# Altium schematic sheet Trigger.SchDoc
size A; SheetNumber: 5; SheetTotal: 6
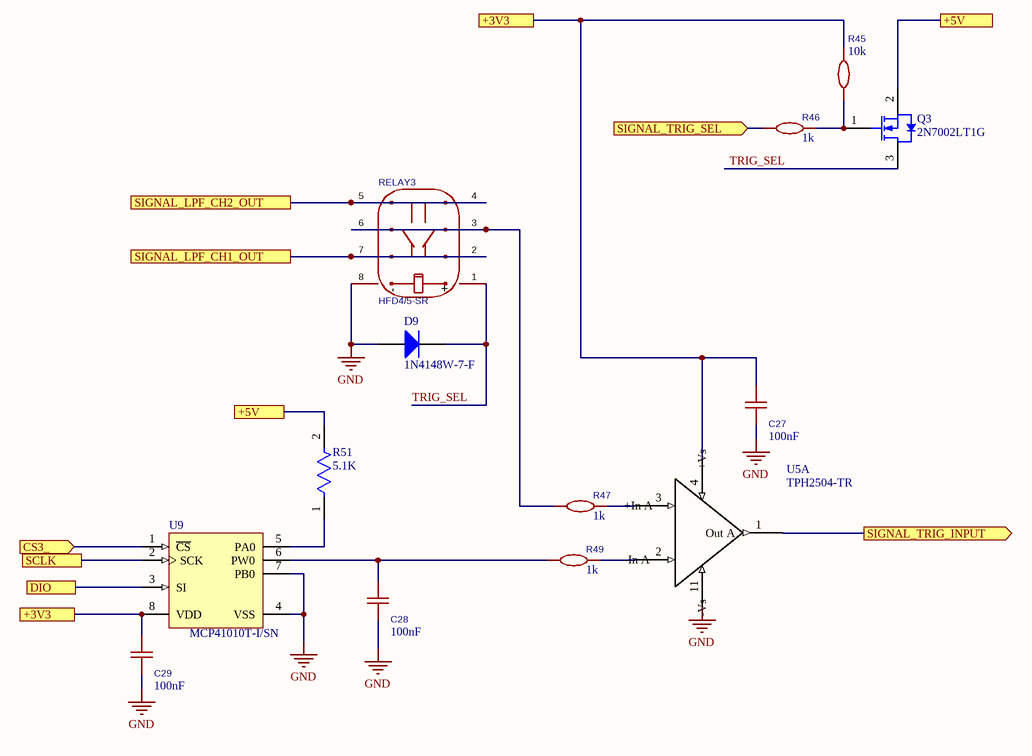
[diagram p0: Trigger.SchDoc]

## Parts
C27  value 100nF  [C0805]  (hidden comment: 0805CG6R0C500NT_C67560)
C28  value 100nF  [C0805]  (hidden comment: 0805CG6R0C500NT_C67560)
C29  value 100nF  [C0805]  (hidden comment: 0805CG6R0C500NT_C67560)
D9  1N4148W-7-F  [DIOD-SOD123-2_V]
Q3  2N7002LT1G  [ONSC-SOT-23-3-318-08_V]
R45  value 10k  [R0805]  (hidden comment: 0805W8F0000T5E_C17477)
R46  value 1k  [R0805]  (hidden comment: 0805W8F0000T5E_C17477)
R47  value 1k  [R0805]  (hidden comment: 0805W8F0000T5E_C17477)
R49  value 1k  [R0805]  (hidden comment: 0805W8F0000T5E_C17477)
R51  5.1K  [FP-RT0805-MFG]
RELAY3  HFD4/5-SR  [RELAY-SMD_HFD4-5-SR]
U5  TPH2504-TR  [TSOP65P640X120-14N]  (part A of 4)
U9  MCP41010T-I/SN  [SOIC-SN8_M]

## Ports
+3V3 (see H723ZG_Interface[1A], PGA[2A], PGA[2B], PGA[4A], PGA[4C], REF_VOLTAGE_RELAY_DRIVER[1A], REF_VOLTAGE_RELAY_DRIVER[2B], REF_VOLTAGE_RELAY_DRIVER[2C], REF_VOLTAGE_RELAY_DRIVER[4A], Trigger[1C]), +3V3 (see H723ZG_Interface[1A], PGA[2A], PGA[2B], PGA[4A], PGA[4C], REF_VOLTAGE_RELAY_DRIVER[1A], REF_VOLTAGE_RELAY_DRIVER[2B], REF_VOLTAGE_RELAY_DRIVER[2C], REF_VOLTAGE_RELAY_DRIVER[4A], Trigger[3A]), +5V (see H723ZG_Interface[1A], PGA[3A], PGA[3C], REF_VOLTAGE_RELAY_DRIVER[2C], REF_VOLTAGE_RELAY_DRIVER[3B], Trigger[2B]), +5V (see H723ZG_Interface[1A], PGA[3A], PGA[3C], REF_VOLTAGE_RELAY_DRIVER[2C], REF_VOLTAGE_RELAY_DRIVER[3B], Trigger[4A]), CS3_ (in, see H723ZG_Interface[3A]), DIO (see H723ZG_Interface[3A], PGA[4B], PGA[4C]), SCLK (see H723ZG_Interface[3A], PGA[4B], PGA[4C]), SIGNAL_LPF_CH1_OUT (see H723ZG_Interface[1C], LPF[4A]), SIGNAL_LPF_CH2_OUT (see H723ZG_Interface[1C], LPF[4C]), SIGNAL_TRIG_INPUT (out, see H723ZG_Interface[4C]), SIGNAL_TRIG_SEL (in, see H723ZG_Interface[4B])

## Nets
GND: C27.2 C28.2 C29.2 D9.1(A) RELAY3.8 U5.11(-Vs) U9.4(VSS) U9.7(PB0)
+3V3: C27.1 C29.1 R45.2 U5.4(+Vs) U9.8(VDD) ; port +3V3
+5V: Q3.2(S) R51.2 ; port +5V
CS3_: U9.1(~{CS}) ; port CS3_
DIO: U9.3(SI) ; port DIO
SCLK: U9.2(SCK) ; port SCLK
SIGNAL_LPF_CH1_OUT: RELAY3.2 RELAY3.7 ; port SIGNAL_LPF_CH1_OUT
SIGNAL_LPF_CH2_OUT: RELAY3.4 RELAY3.5 ; port SIGNAL_LPF_CH2_OUT
SIGNAL_TRIG_INPUT: U5.1(Out_A) ; port SIGNAL_TRIG_INPUT
SIGNAL_TRIG_SEL: R46.1 ; port SIGNAL_TRIG_SEL
TRIG_SEL: D9.2(K) Q3.3(D) RELAY3.1
NetC28_1: C28.1 R49.1 U9.6(PW0)
NetQ3_1: Q3.1(G) R45.1 R46.2
NetR47_1: R47.1 RELAY3.3 RELAY3.6
NetR47_2: R47.2 U5.3(+In_A)
NetR49_2: R49.2 U5.2(-In_A)
NetR51_1: R51.1 U9.5(PA0)

## Notes on the sheet
- (in symbol CMP-006-000000-2) -; +

## Library data of the parts
C27-C29 = CMP-015-000003-2: Capacitance:100nF Tolerance:±5% Tolerance:±5% Voltage Rating:50V Temperature Coefficient:X7R; Manufacturer: YAGEO(国巨); AddInBom: yes; Device: CC0805JRX7R9BB104; ModelId: 8c88e81f49c6409b980720ec8953afb6聨0819f05c4eef4c71ace90d822a990e87; ModelName: C0805_L2.0-W1.3-H1.3; ModelTransform: 78.74,51.181,0,0,0,0,0,0.0005,0; Temperature Coefficient: X7R; Tolerance: 5%; Voltage Rating: 50V; ConvertToPcb: yes; Datasheet: https://item.szlcsc.com/datasheet/CC0805JRX7R9BB104/112720.html; Design Item ID: CC0805JRX7R9BB104; FootprintName: C0805; JLCPCB Part Class: Extended Part; LCSC Part Name: 100nF ±5% 50V; Source: P1.SCHLIB; Supplier Footprint: 0805; Symbol: CC0805JRX7R9BB104; Manufacturer Part Number: CC0805JRX7R9BB104; Supplier Part Number: C111492
D9 = CMP-2000-04932-2: Fast Switching Diode, 100 V, 0.15 A, -65 to 150 degC, 2-Pin?SOD123, RoHS, Tape and Reel; Manufacturer: Diodes Inc; Recovery Time: 4ns; Unit Weight: 0.000353oz; Max Surge Current: 2A; Peak Reverse Voltage: 100V; Ir - Reverse Current: 1uA; Vf - Forward Voltage: 1.25V; Configuration: Single; If - Forward Current: 0.15A; Product Category: Diodes-GeneralPurpose,Power,Switching; Operating Temperature Range: -65Cto+150C; Packaging: Reel; Manufacturer URL: http://www.diodes.com/; Maximum Operating Temperature: +150C; Height: 1.25mm; Minimum Operating Temperature: -65C; Product: SwitchingDiodes; Package URL: http://www.diodes.com/datasheets/ds18004.pdf; Type: SwitchingDiode; Package Reference: SOD123-2; Width: 1.7mm; Datasheet URL: http://www.farnell.com/datasheets/1915529.pdf; Datasheet Version: Rev. 24-2, 10/2013; Series: 1N4148; Factory Pack Quantity: 3000; Length: 2.85mm; RoHS: True; Mounting Style: SMD/SMT; Package / Case: SOD-123
Q3 = CMP-1058-00781-1: Small Signal MOSFET, 60 V, 115 mA, N-Channel, 3-Pin SOT-23, Pb-Free, Tape and Reel; Manufacturer: On Semiconductor; Channel Polarity: N Channel; V(BR)DSS Min (V): 60; ID Max (A): 0.115; VGS Max (V): 20; Configuration: Single; VGS(th) Max (V): 2.5; ComponentLink1URL: http://www.onsemi.com/; ComponentLink3Description: Package Specification; ComponentLink3URL: http://www.onsemi.cn/pub_link/Collateral/318-08.PDF; PackageReference: SOT-23-3-318-08; RoHS: Pb-Free; ComponentLink2URL: http://www.onsemi.com/pub_link/Collateral/2N7002L-D.PDF; ComponentLink1Description: Manufacturer URL; Package Type: SOT-23-3; Packing: Tape and Reel; PartNumber: 2N7002LT1G; DatasheetVersion: Rev. 7; Mounting Technology: Surface Mount; ComponentLink2Description: Datasheet; PackageDescription: 3-Pin Small Outline Transistor, Body 2.92 x 1.3 mm, Pitch 0.95 mm; PackageVersion: Rev. AP, 11/2009
R45 = CMP-016-000002-1: Type:Thick Film Resistor Resistance:10kΩ Tolerance:±1% Tolerance:±1% Power(Watts):125mW Voltage-Supply(Max):150V Temperature Coefficient:±100ppm/℃ Temperature Coefficient:±100ppm/℃ Operating Temperature:-55℃~+155℃ Operating Temperature:-55℃~+155℃; Manufacturer: UNI-ROYAL(厚声); AddInBom: yes; Device: 0805W8F1002T5E; ModelId: b83c7c5430874b8eb2319a65d9433429聨0819f05c4eef4c71ace90d822a990e87; ModelName: R0805_L2.0-W1.3-H0.6; ModelTransform: 78.74,51.181,0,0,0,0,0,-0.0005,0; Power(Watts): 125mW; Tolerance: 1%; Voltage-Supply(Max): 150V; ConvertToPcb: yes; Datasheet: https://item.szlcsc.com/datasheet/0805W8F1002T5E/18102.html; Design Item ID: 0805W8F1002T5E; FootprintName: R0805; JLCPCB Part Class: Basic Part; LCSC Part Name: 10kΩ ±1% 125mW 厚膜电阻; Operating Temperature: -55℃~+155℃; Source: P1.SCHLIB; Supplier Footprint: 0805; Symbol: 0805W8F1002T5E; Temperature Coefficient: ±100ppm/℃; Type: Thick Film Resistor; Manufacturer Part Number: 0805W8F1002T5E; Supplier Part Number: C17414
R46 R47 R49 = CMP-016-000001-1: Type:Thick Film Resistors Resistance:1kΩ Tolerance:±1% Tolerance:±1% Power(Watts): Overload Voltage (Max): Temperature Coefficient:±100ppm/℃ Temperature Coefficient:±100ppm/℃ Operating Temperature Range:-55℃~+155℃ Operating Temperature Range:-55℃~+155℃; Manufacturer: UNI-ROYAL(厚声); AddInBom: yes; Device: 0805W8F1001T5E; ModelId: b83c7c5430874b8eb2319a65d9433429聨0819f05c4eef4c71ace90d822a990e87; ModelName: R0805_L2.0-W1.3-H0.6; ModelTransform: 78.74,51.181,0,0,0,0,0,-0.0005,0; Tolerance: 1%; ConvertToPcb: yes; Datasheet: https://atta.szlcsc.com/upload/public/pdf/source/20200306/C422600_1E6D84923E4A46A82E41ADD87F860B5C.pdf; Design Item ID: 0805W8F1001T5E; FootprintName: R0805; JLCPCB Part Class: Basic Part; LCSC Part Name: 1kΩ ±1% 125mW 厚膜电阻; Operating Temperature Range: -55℃~+155℃; Source: P1.SCHLIB; Supplier Footprint: 0805; Symbol: 0805W8F1001T5E; Temperature Coefficient: ±100ppm/℃; Type: Thick Film Resistors; Manufacturer Part Number: 0805W8F1001T5E; Supplier Part Number: C17513
R51 = CMP-00006-1: 125mW Thin Film Resistor ±50ppm/℃ ±1% 5.1kΩ 0805 Chip Resistor - Surface Mount ROHS; Manufacturer Package Identifier: 0805 (2012 metric); Voltage Rating: 150V; Temperature Coefficient: 50ppm/°C; Depth: 1.25mm; Max Power Dissipation: 125mW; Lifecycle Status: Production; Min Operating Temperature: -55°C; Mounting Technology: Surface Mount; Value: 5.1kΩ; Case Code (Imperial): 0805; Max Operating Temperature: 155°C; Radiation Hardening: No; Power Rating: 125mW; Number of Terminals: 2; Voltage Rating (DC): 150V; Case/Package: 0805; Length: 2mm; RoHS: Compliant; Number of Terminations: 2; China RoHS: Non-Compliant; Working Voltage: 150V; Termination: SMD/SMT; Military Standard: Not; Composition: Thin Film; Height: 500µm; Tolerance: 1%; REACH SVHC: Yes; Contact Plating: Tin; Width: 1.25mm; Lead Free: Lead Free
RELAY3 = CMP-006-000000-2: Coil Voltage:5V Contact Form:2 Form C: 2C (DPDT-CO) Number of Pins:8 Contact Rating:1A@30VDC；300mA@125VAC Switching Voltage(Max):250V@AC；220V@DC Contact Material:AgNi + Gold plated Coil Rated Power:140mW Coil Resistance:178Ω Switching Current(Max):2A Oper; Manufacturer: HF(宏发); Release Time: 3ms; Coil Voltage: 5V; Coil Type: Polarized-Single Coil; AddInBom: yes; ModelName: RELAY-SMD_L10.0-W6.5-H5.7-LS7.5-P2.2; ModelTransform: 393.7,307.086,0,0,0,0,-0.005,0,0; ModelId: abc4320b17a04819849f22b1ebcd3fe7聨0819f05c4eef4c71ace90d822a990e87; Switching Current(Max): 2A; Coil Resistance: 178Ω; Coil Rated Power: 140mW; Contact Resistance: 100mΩ; Contact Rating: 1A@30VDC；300mA@125VAC; Symbol: HFD4/5-S; JLCPCB Part Class: Extended Part; Operating Temperature: -40℃~+85℃; ConvertToPcb: yes; FootprintName: RELAY-SMD_HFD4-5-SR; Supplier Footprint: SMD,10x6.5mm; Device: HFD4/5-SR; Switching Voltage(Max): 250V@AC；220V@DC; Contact Form: 2 Form C: 2C (DPDT-CO); Datasheet: https://item.szlcsc.com/datasheet/HFD4%252F5-SR/65466.html; Contact Material: AgNi + Gold plated; Design Item ID: HFD4/5-SR; Number of Pins: 8; LCSC Part Name: 超小型5V继电器 双刀双掷; Source: P1.SCHLIB; Operate Time: 3ms; Manufacturer Part Number: HFD4/5-SR; Supplier Part Number: C64399
U5 = CMP-00002-9: Operational Amplifier, 4 Func, 5000uV Offset-Max, CMOS, PDSO14; Max Supply Voltage: 7V; Number of Circuits: 4; Nominal Supply Voltage (DC): 3V; Input Offset Voltage (Vos): 5mV; Max Supply Current: 48mA; GAIN: 120Meg; Unity Gain Bandwidth Product: 120MHz; Common Mode Rejection Ratio: 45dB; Slew Rate: 160V/µs; Number of Terminals: 14; Terminal Pitch: 650µm; Max Operating Temperature: 125°C; Height - Seated (Max): 1.2mm; Length: 4.96mm; Min Operating Temperature: -40°C; RoHS: Compliant; Width: 4.4mm; Case/Package: TSSOP; Temperature Grade: Automotive
U9 = CMP-0188-00466-2: Single/Dual Digital Potentiometer with SPI Interface, 8-Pin SOIC 150mil, Industrial Temperature, Tape and Reel; ComponentLink2URL: http://ww1.microchip.com/downloads/en/DeviceDoc/11195c.pdf; PackageReference: SOIC-SN8; PackageDescription: 8-Lead Plastic Small Outline (SN) - Narrow, 3.90mm Body [SOIC]; ComponentLink3URL: http://www.microchip.com/stellent/groups/techpub_sg/documents/packagingspec/en012702.pdf; ComponentLink2Description: Datasheet; Code_JEDEC: MS-012; ComponentLink1URL: http://www.microchip.com/; PackageVersion: revBB, Aug-2009; DatasheetVersion: Jul-2003; ComponentLink1Description: Manufacturer URL; ComponentLink3Description: Package Specification; Code_IPC: SOIC127P600-8; RevisionNote: URLs added.